# Altium project DAQ Schematics.PrjPcb
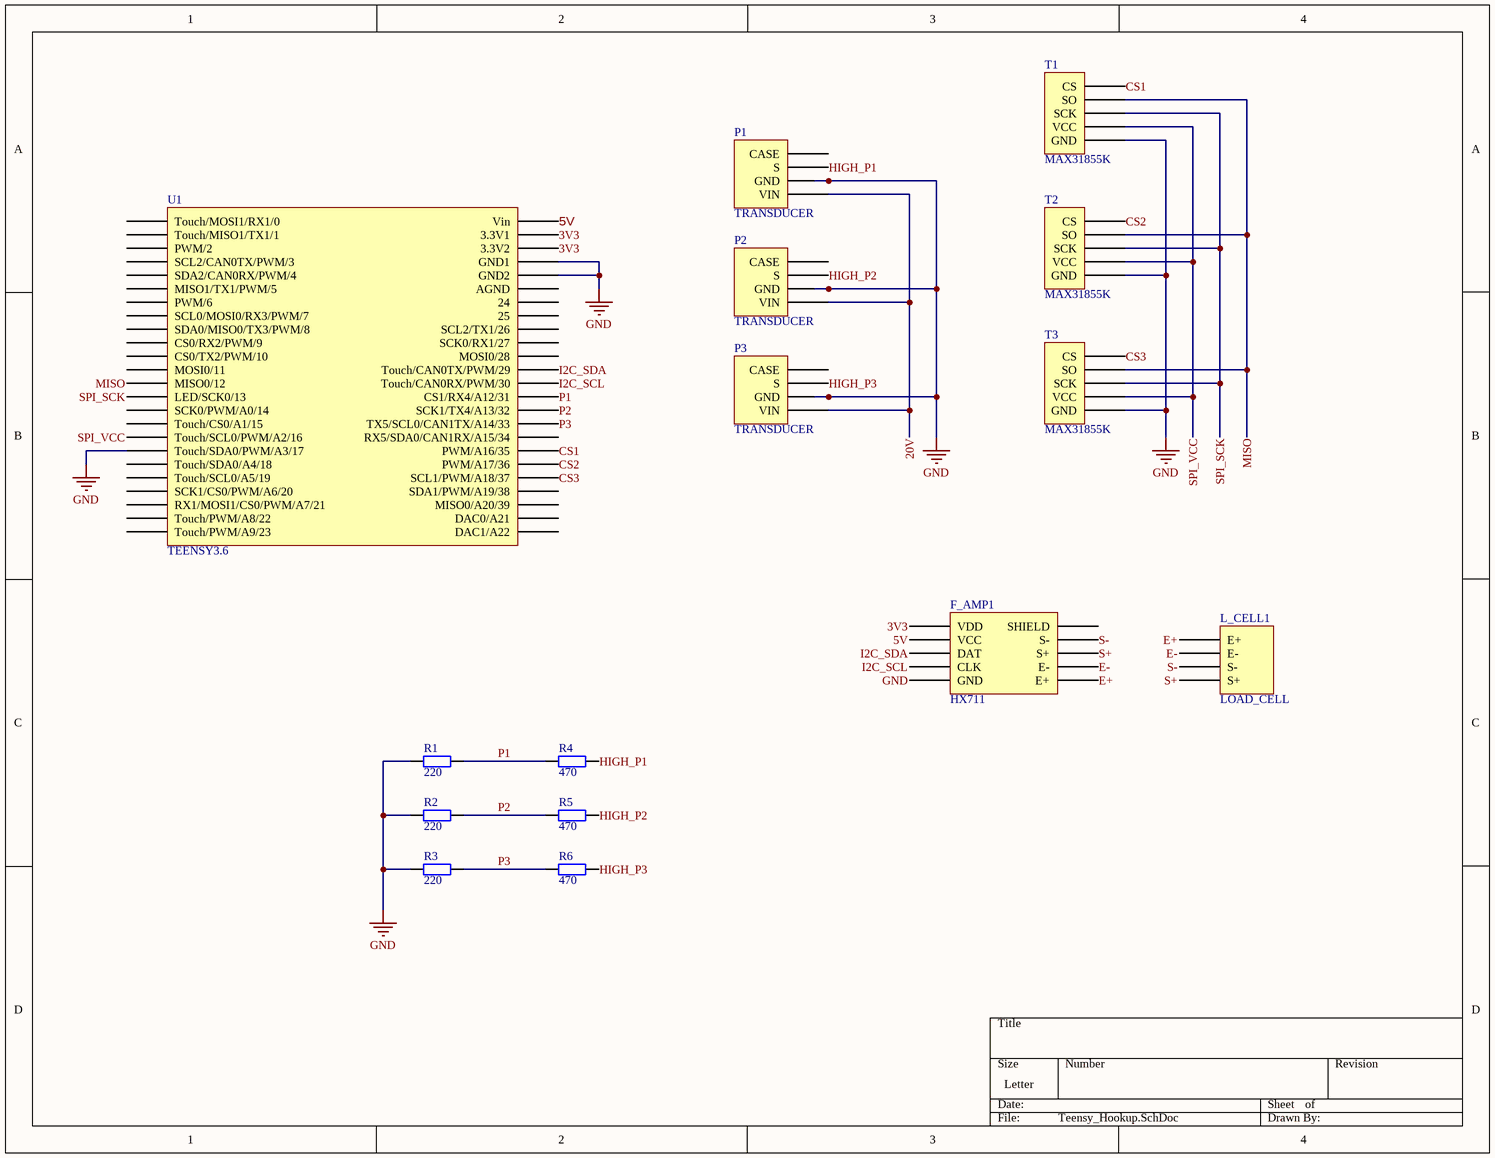
[diagram p0: Teensy_Hookup.SchDoc]
2 sheets, 19 parts. Net scope: global (net labels, ports and power ports of the same name join across sheets).
Sheets:
  Teensy_Hookup.SchDoc
  Power.SchDoc

## Sheet Teensy_Hookup.SchDoc: Teensy
size Letter; DrawnBy: Carter Mak; Revision: 1

### Parts
F_AMP1  HX711
L_CELL1  LOAD_CELL
P1  TRANSDUCER
P2  TRANSDUCER
P3  TRANSDUCER
R1  value 220  [AXIAL-0.4]
R2  value 220  [AXIAL-0.4]
R3  value 220  [AXIAL-0.4]
R4  value 470  [AXIAL-0.4]
R5  value 470  [AXIAL-0.4]
R6  value 470  [AXIAL-0.4]
T1  MAX31855K
T2  MAX31855K
T3  MAX31855K
U1  TEENSY3.6

### Nets
GND: F_AMP1.5(GND) P1.2(GND) P2.2(GND) P3.2(GND) R1.1 R2.1 R3.1 T1.1(GND) T2.1(GND) T3.1(GND) U1.17(Touch/SDA0/PWM/A3/17) U1.GND1 U1.GND2
3V3: F_AMP1.1(VDD) U1.3.3V1 U1.3.3V2
5V: F_AMP1.2(VCC) U1.VIN(Vin)
20V: P1.1(VIN) P2.1(VIN) P3.1(VIN)
CS1: T1.5(CS) U1.35(PWM/A16/35)
CS2: T2.5(CS) U1.36(PWM/A17/36)
CS3: T3.5(CS) U1.37(SCL1/PWM/A18/37)
E+: F_AMP1.6(E+) L_CELL1.1(E+)
E-: F_AMP1.7(E-) L_CELL1.2(E-)
HIGH_P1: P1.3(S) R4.2
HIGH_P2: P2.3(S) R5.2
HIGH_P3: P3.3(S) R6.2
I2C_SCL: F_AMP1.4(CLK) U1.30(Touch/CAN0RX/PWM/30)
I2C_SDA: F_AMP1.3(DAT) U1.29(Touch/CAN0TX/PWM/29)
MISO: T1.4(SO) T2.4(SO) T3.4(SO) U1.12(MISO0/12)
P1: R1.2 R4.1 U1.31(CS1/RX4/A12/31)
P2: R2.2 R5.1 U1.32(SCK1/TX4/A13/32)
P3: R3.2 R6.1 U1.33(TX5/SCL0/CAN1TX/A14/33)
S+: F_AMP1.8(S+) L_CELL1.4(S+)
S-: F_AMP1.9(S-) L_CELL1.3(S-)
SPI_SCK: T1.3(SCK) T2.3(SCK) T3.3(SCK) U1.13(LED/SCK0/13)
SPI_VCC: T1.2(VCC) T2.2(VCC) T3.2(VCC) U1.16(Touch/SCL0/PWM/A2/16)

Not connected (* = marked no-connect by the designer): F_AMP1 10(SHIELD); P1 4(CASE); P2 4(CASE); P3 4(CASE); U1 0(Touch/MOSI1/RX1/0) 1(Touch/MISO1/TX1/1) 2(PWM/2) 3(SCL2/CAN0TX/PWM/3) 4(SDA2/CAN0RX/PWM/4) 5(MISO1/TX1/PWM/5) 6(PWM/6) 7(SCL0/MOSI0/RX3/PWM/7) 8(SDA0/MISO0/TX3/PWM/8) 9(CS0/RX2/PWM/9) 10(CS0/TX2/PWM/10) 11(MOSI0/11) 14(SCK0/PWM/A0/14) 15(Touch/CS0/A1/15) 18(Touch/SDA0/A4/18) 19(Touch/SCL0/A5/19) 20(SCK1/CS0/PWM/A6/20) 21(RX1/MOSI1/CS0/PWM/A7/21) 22(Touch/PWM/A8/22) 23(Touch/PWM/A9/23) 24 25 26(SCL2/TX1/26) 27(SCK0/RX1/27) 28(MOSI0/28) 34(RX5/SDA0/CAN1RX/A15/34) 38(SDA1/PWM/A19/38) 39(MISO0/A20/39) A21(DAC0/A21) A22(DAC1/A22) AGND

### Library data of the parts
R1-R6 = Res2: Resistor; Published: 8-Jun-2000; LatestRevisionDate: 17-Jul-2002; LatestRevisionNote: Re-released for DXP Platform.; PackageReference: AXIAL-0.4; Publisher: Altium Limited; PackageDescription: Axial Device, Thru-Hole; 2 Leads; 0.4 in Pin Spacing

## Sheet Power.SchDoc
size A
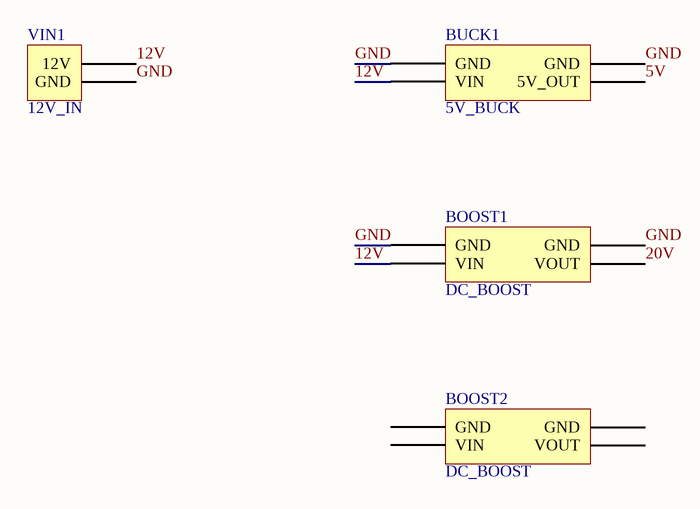
[diagram p1: Power.SchDoc]

### Parts
BOOST1  DC_BOOST
BOOST2  DC_BOOST
BUCK1  5V_BUCK
VIN1  12V_IN

### Nets
GND: BOOST1.1(GND) BOOST1.4(GND) BUCK1.1(GND) BUCK1.4(GND) VIN1.1(GND)
5V: BUCK1.3(5V_OUT)
12V: BOOST1.2(VIN) BUCK1.2(VIN) VIN1.2(12V)
20V: BOOST1.3(VOUT)

Not connected (* = marked no-connect by the designer): BOOST2 1(GND) 2(VIN) 3(VOUT) 4(GND)

### Library data of the parts
BOOST1 = DC_BOOST: Boost converter for 20V power for pressure transducers

## Nets that join several sheets
GND: Teensy_Hookup (13 pins), Power (5 pins)
5V: Teensy_Hookup (F_AMP1.2 U1.VIN), Power (BUCK1.3)
20V: Teensy_Hookup (P1.1 P2.1 P3.1), Power (BOOST1.3)